# EAGLE design wemos_d1_mini_pro (EAGLE 9.6.2)
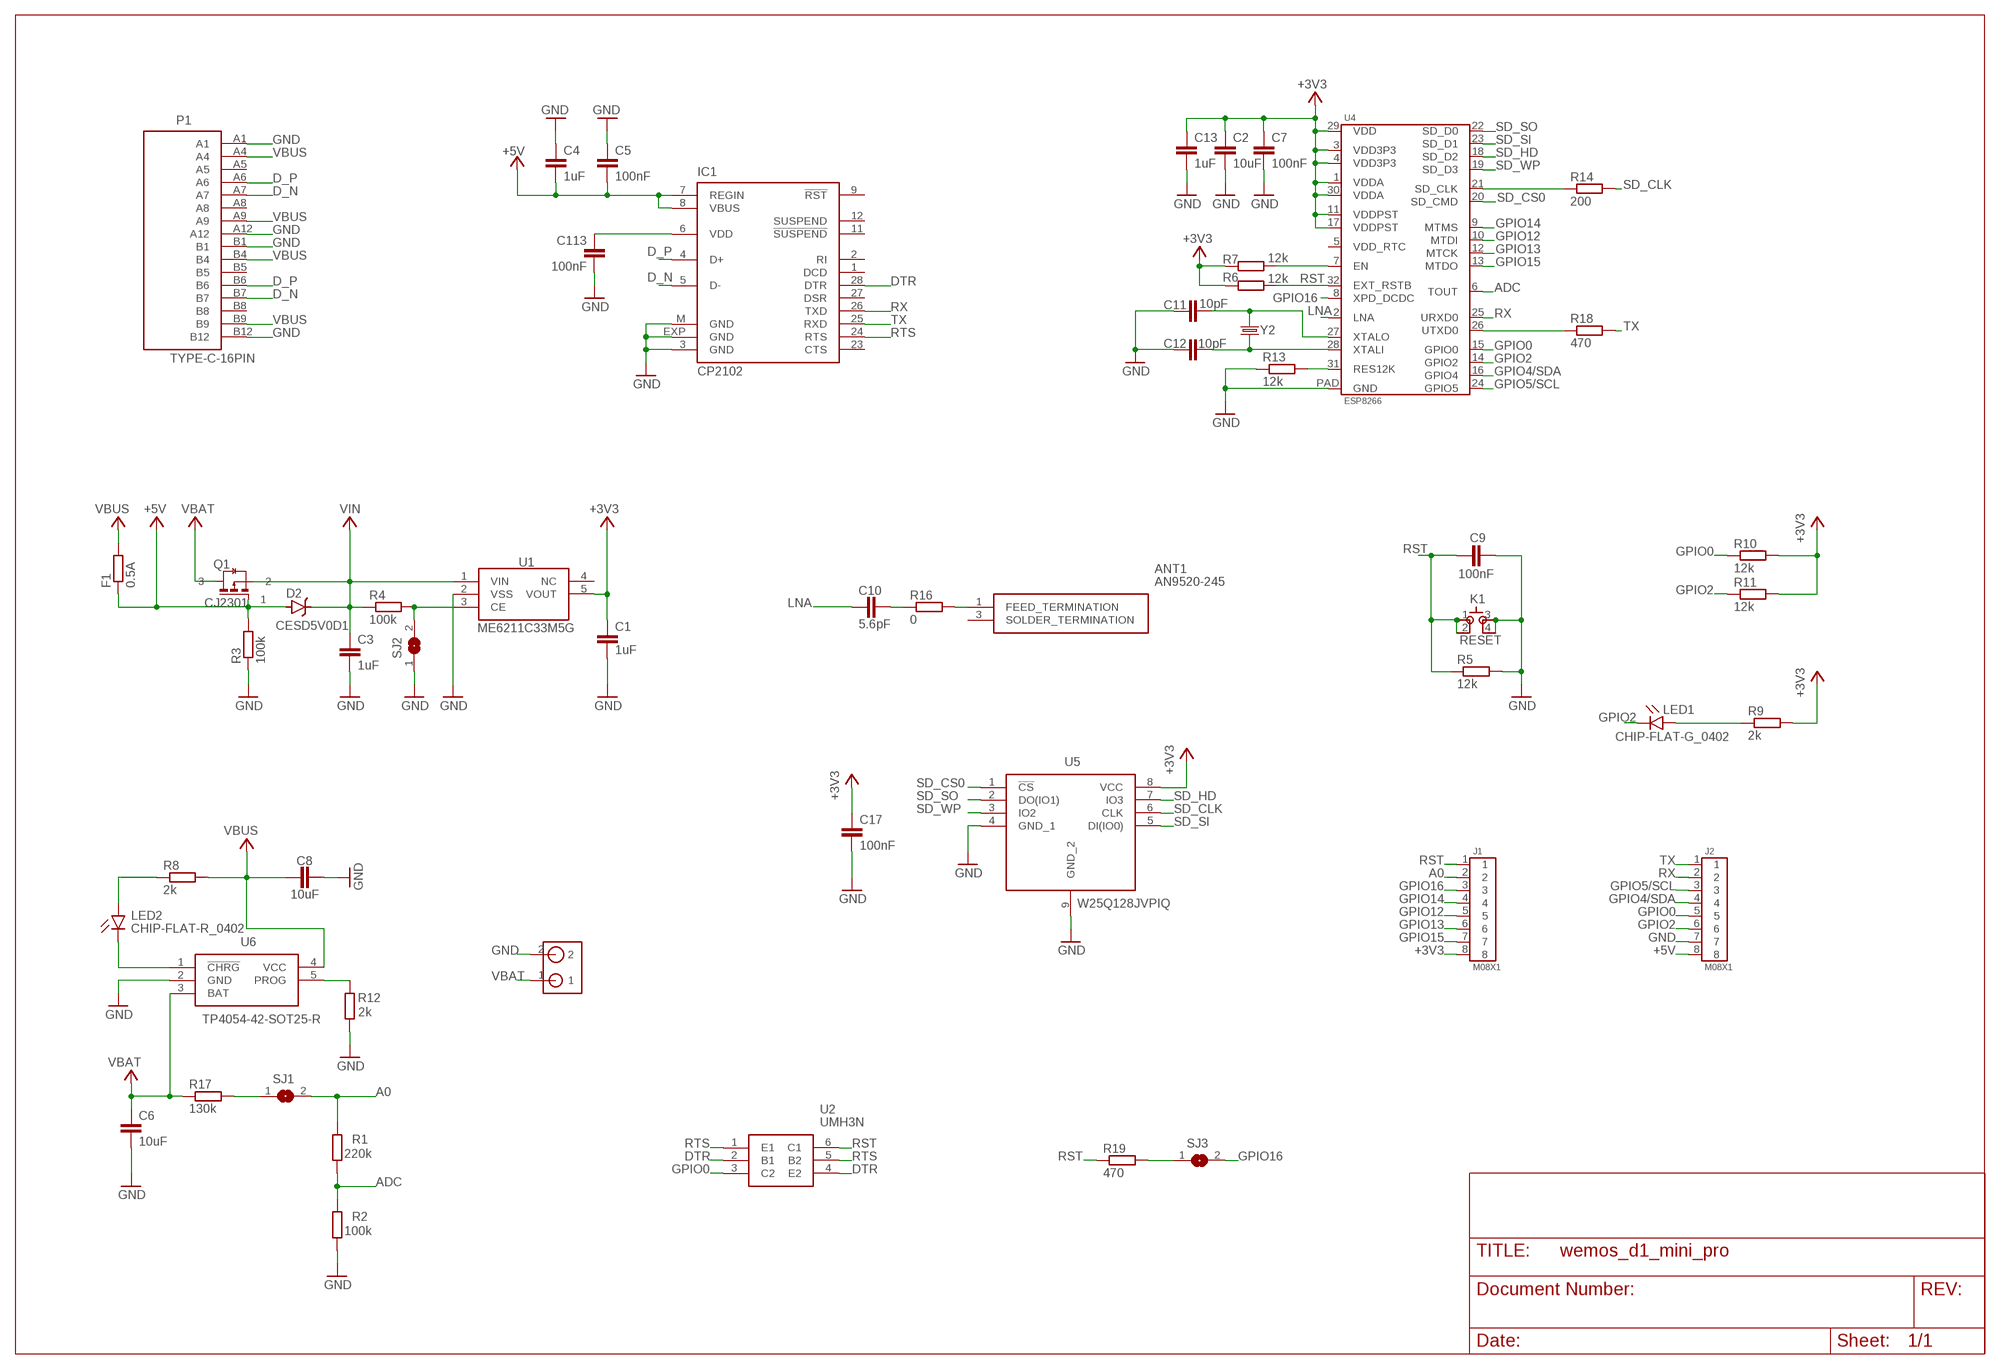
[diagram p0: schematic, sheet 1]

## Parts
ANT1  AN9520-245  [AN9520245]
C1  1uF  C-EUC0402  [C0402]
C2  10uF  C-EUC0402  [C0402]
C3  1uF  C-EUC0402  [C0402]
C4  1uF  C-EUC0402  [C0402]
C5  100nF  C-EUC0402  [C0402]
C6  10uF  C-EUC0402  [C0402]
C7  100nF  C-EUC0402  [C0402]
C8  10uF  C-EUC0402  [C0402]
C9  100nF  C-EUC0402  [C0402]
C10  5.6pF  C-EUC0402  [C0402]
C11  10pF  C-EUC0402  [C0402]
C12  10pF  C-EUC0402  [C0402]
C13  1uF  C-EUC0402  [C0402]
C17  100nF  C-EUC0402  [C0402]
C113  100nF  C-EUC0402  [C0402]
D2  CESD5V0D1  [SOD-123]
F1  0.5A  R-EU_R0402  [R0402]
IC1  CP2102  [MLP28]
J1  M08X1  [M08X1]
J2  M08X1  [M08X1]
K1  RESET  SKSCLDE010  [SKSCLDE010]
LED1  CHIP-FLAT-G_0402  [LEDC1005X25N_FLAT-G]
LED2  CHIP-FLAT-R_0402  [LEDC1005X25N_FLAT-R]
P1  TYPE-C-16PIN  [TYPE-C-16PIN]
Q1  CJ2301  [SOT95P240X115-3N]
R1  220k  R-EU_R0402  [R0402]
R2  100k  R-EU_R0402  [R0402]
R3  100k  R-EU_R0402  [R0402]
R4  100k  R-EU_R0402  [R0402]
R5  12k  R-EU_R0402  [R0402]
R6  12k  R-EU_R0402  [R0402]
R7  12k  R-EU_R0402  [R0402]
R8  2k  R-EU_R0402  [R0402]
R9  2k  R-EU_R0402  [R0402]
R10  12k  R-EU_R0402  [R0402]
R11  12k  R-EU_R0402  [R0402]
R12  2k  R-EU_R0402  [R0402]
R13  12k  R-EU_R0402  [R0402]
R14  200  R-EU_R0402  [R0402]
R16  0  R-EU_R0402  [R0402]
R17  130k  R-EU_R0402  [R0402]
R18  470  R-EU_R0402  [R0402]
R19  470  R-EU_R0402  [R0402]
SJ1  SJ  [SJ]
SJ2  SJ  [SJ]
SJ3  SJ  [SJ]
U1  ME6211C33M5G  [SOT95P282X145-5N]
U2  UMH3N  [SOT65P230X110-6N]
U4  ESP8266  [ESP8266]
U5  W25Q128JVPIQ  [SON127P800X600X80-9N]
U6  TP4054-42-SOT25-R  [SOT95P280X100-5N]
U$1  ZH1.25  [1.25X2-FLAT]
Y2  YSX321SL  [SMD-3225-4]

## Nets
+3V3: C1.1 C2.1 C7.1 C13.1 C17.1 J1.8 R6.1 R7.1 R9.2 R10.2 R11.2 U1.5(VOUT) U4.1(VDDA) U4.3(VDD3P3) U4.4(VDD3P3) U4.11(VDDPST) U4.17(VDDPST) U4.29(VDD) U4.30(VDDA) U5.8(VCC)
+5V: C4.2 C5.2 D2.A F1.1 IC1.7(REGIN) IC1.8(VBUS) J2.8 Q1.1 R3.2
A0: J1.2 R1.2 SJ1.2
ADC: R1.1 R2.2 U4.6(TOUT)
D_N: IC1.5(D-) P1.A7 P1.B7
D_P: IC1.4(D+) P1.A6 P1.B6
DTR: IC1.28(DTR) U2.2(B1) U2.4(E2)
EN: R4.2 SJ2.2 U1.3(CE)
GND: C1.2 C2.2 C3.2 C4.1 C5.1 C6.2 C7.2 C8.2 C9.2 C11.1 C12.1 C13.2 C17.2 C113.2 IC1.3(GND) IC1.EXP(GND) IC1.M(GND) J2.7 K1.3 K1.4 P1.A1 P1.A12 P1.B1 P1.B12 R2.1 R3.1 R5.2 R12.1 R13.1 SJ2.1 U1.2(VSS) U4.PAD(GND) U5.4(GND_1) U5.9(GND_2) U6.2(GND) U$1.2
GPIO0: J2.5 R10.1 U2.3(C2) U4.15(GPIO0)
GPIO2: J2.6 LED1.C R11.1 U4.14(GPIO2)
GPIO4/SDA: J2.4 U4.16(GPIO4)
GPIO5/SCL: J2.3 U4.24(GPIO5)
GPIO12: J1.5 U4.10(MTDI)
GPIO13: J1.6 U4.12(MTCK)
GPIO14: J1.4 U4.9(MTMS)
GPIO15: J1.7 U4.13(MTDO)
GPIO16: J1.3 SJ3.2 U4.8(XPD_DCDC)
LNA: C10.1 U4.2(LNA)
N$1: C113.1 IC1.6(VDD)
N$2: C12.2 U4.28(XTALI) Y2.1
N$3: C11.2 U4.27(XTALO) Y2.3
N$4: R13.2 U4.31(RES12K)
N$5: R7.2 U4.7(EN)
N$6: R12.2 U6.5(PROG)
N$7: C10.2 R16.1
N$8: R14.1 U4.21(SD_CLK)
N$9: R18.1 U4.26(UTXD0)
N$10: ANT1.1(FEED_TERMINATION) R16.2
N$11: LED1.A R9.1
N$12: LED2.A R8.1
N$13: LED2.C U6.1(!CHRG)
N$14: R17.2 SJ1.1
N$16: R19.2 SJ3.1
RST: C9.1 J1.1 K1.1 K1.2 R5.1 R6.2 R19.1 U2.6(C1) U4.32(EXT_RSTB)
RTS: IC1.24(RTS) U2.1(E1) U2.5(B2)
RX: IC1.26(TXD) J2.2 U4.25(URXD0)
SD_CLK: R14.2 U5.6(CLK)
SD_CS0: U4.20(SD_CMD) U5.1(!CS)
SD_HD: U4.18(SD_D2) U5.7(IO3)
SD_SI: U4.23(SD_D1) U5.5(DI(IO0))
SD_SO: U4.22(SD_D0) U5.2(DO(IO1))
SD_WP: U4.19(SD_D3) U5.3(IO2)
TX: IC1.25(RXD) J2.1 R18.2
VBAT: C6.1 Q1.3 R17.1 U6.3(BAT) U$1.1
VBUS: C8.1 F1.2 P1.A4 P1.A9 P1.B4 P1.B9 R8.2 U6.4(VCC)
VIN: C3.1 D2.C Q1.2 R4.1 U1.1(VIN)
Unconnected: ANT1.3(SOLDER_TERMINATION) IC1.1(DCD) IC1.2(RI) IC1.9(!RST) IC1.11(!SUSPEND) IC1.12(SUSPEND) IC1.23(CTS) IC1.27(DSR) P1.A5 P1.A8 P1.B5 P1.B8 U1.4(NC) U4.5(VDD_RTC)

## Library data of the parts
ANT1 = antenna:AN9520-245: SMD Antennas RoHS Source: Datasheet <https://datasheet.lcsc.com/szlcsc/1810251713_Rainsun-microwave-Tech-AN9520-245_C99665.pdf>; DESCRIPTION: SMD Antennas RoHS; HEIGHT: 1.2mm; MANUFACTURER_NAME: Rainsun microwave Tech; MANUFACTURER_PART_NUMBER: AN9520-245
C1-C13 C17 C113 = rcl:C-EU: CAPACITOR, European symbol; SPICEPREFIX: C
D2 = Diodes:CESD5V0D1: SOD-123 Plastic-Encapsulate Diodes Uni-direction ESD Protection Diode Manufacturer's datasheet <https://seeeddoc.github.io/Open_parts_library/res/304060001.pdf>; CREATED_BY: PCBLayout.com; MANUFACTURER: JCET; MPN: CESD5V0D1; PACKAGE: SOD-123
F1 R1-R14 R16-R19 = rcl:R-EU_: RESISTOR, European symbol; SPICEPREFIX: R
IC1 = silabs:CP210*: Single-Chip USB to UART Bridge Source: www.silabs.com .. CP2101.pdf / cp2102.pdf; MF: FARNELL; MPN: CP2102-GM; OC_FARNELL: 9282130; OC_NEWARK: 30K5635
J1 J2 = Connectors:M08X1
K1 = alps:SKSCLDE010
LED1 = LED:CHIP-FLAT-G; CATEGORY: LED; COLOR: GREEN; DESCRIPTION: CHIP LED FLAT; SUB-CATEGORY: CHIP; TYPE: FLAT_TOP
LED2 = LED:CHIP-FLAT-R; CATEGORY: LED; COLOR: RED; DESCRIPTION: CHIP LED FLAT; SUB-CATEGORY: CHIP; TYPE: FLAT_TOP
P1 = usb:TYPE-C-16PIN
Q1 = library:CJ2301
SJ1-SJ3 = jumper:SJ: SMD solder JUMPER
U1 = library:ME6211C33M5G: High Speed LDO Regulators, High PSRR, Low noise, ME6211 Series Source: Datasheet <http://xinhuidianzi.com.cn/UploadSysFiles/files/LDO-series/ME6211-Series_E15.0.pdf>; DESCRIPTION: High Speed LDO Regulators, High PSRR, Low noise, ME6211 Series; HEIGHT: 1.45mm; MANUFACTURER_NAME: Microne; MANUFACTURER_PART_NUMBER: ME6211C33M5G
U2 = UMH3N:UMH3N: 2 NPN pre-biased (Dual) 100mA 50V SC-70-6(SOT-363) Digital Transistors RoHS Source: Datasheet <https://datasheet.lcsc.com/szlcsc/Changjiang-Electronics-Tech-CJ-UMH3N_C62892.pdf>; DESCRIPTION: 2 NPN pre-biased (Dual) 100mA 50V SC-70-6(SOT-363) Digital Transistors RoHS; HEIGHT: 1.1mm; MANUFACTURER_NAME: Changjiang Electronics Tech (CJ); MANUFACTURER_PART_NUMBER: UMH3N
U4 = Espressif:ESP8266
U5 = flash:W25Q128JVPIQ: IC FLASH 128M SPI 133MHZ 8WSON Source: Datasheet <https://www.arrow.com/en/products/w25q128jvpiq/winbond-electronics>; ARROW_PART_NUMBER: W25Q128JVPIQ; ARROW_PRICE-STOCK: https://www.arrow.com/en/products/w25q128jvpiq/winbond-electronics; DESCRIPTION: IC FLASH 128M SPI 133MHZ 8WSON; HEIGHT: 0.8mm; MANUFACTURER_NAME: Winbond; MANUFACTURER_PART_NUMBER: W25Q128JVPIQ; MOUSER_PART_NUMBER: 454-W25Q128JVPIQ; MOUSER_PRICE-STOCK: https://www.mouser.co.uk/ProductDetail/Winbond/W25Q128JVPIQ?qs=qSfuJ%252Bfl%2Fd676hAD%252B1JSfw%3D%3D
U6 = TP4054-42-SOT25-R:TP4054-42-SOT25-R: Standalone Linear Li-ion Battery Charger with Thermal Regulation, SOT-23-5 Source: Datasheet <http://images.100y.com.tw/pdf_file/38-TP-TP4054x.pdf>; DESCRIPTION: Standalone Linear Li-ion Battery Charger with Thermal Regulation, SOT-23-5; HEIGHT: 1mm; MANUFACTURER_NAME: TOP POWER; MANUFACTURER_PART_NUMBER: TP4054-42-SOT25-R
U$1 = Connectors:ZH1.25
Y2 = crystal:YSX321SL

## Board
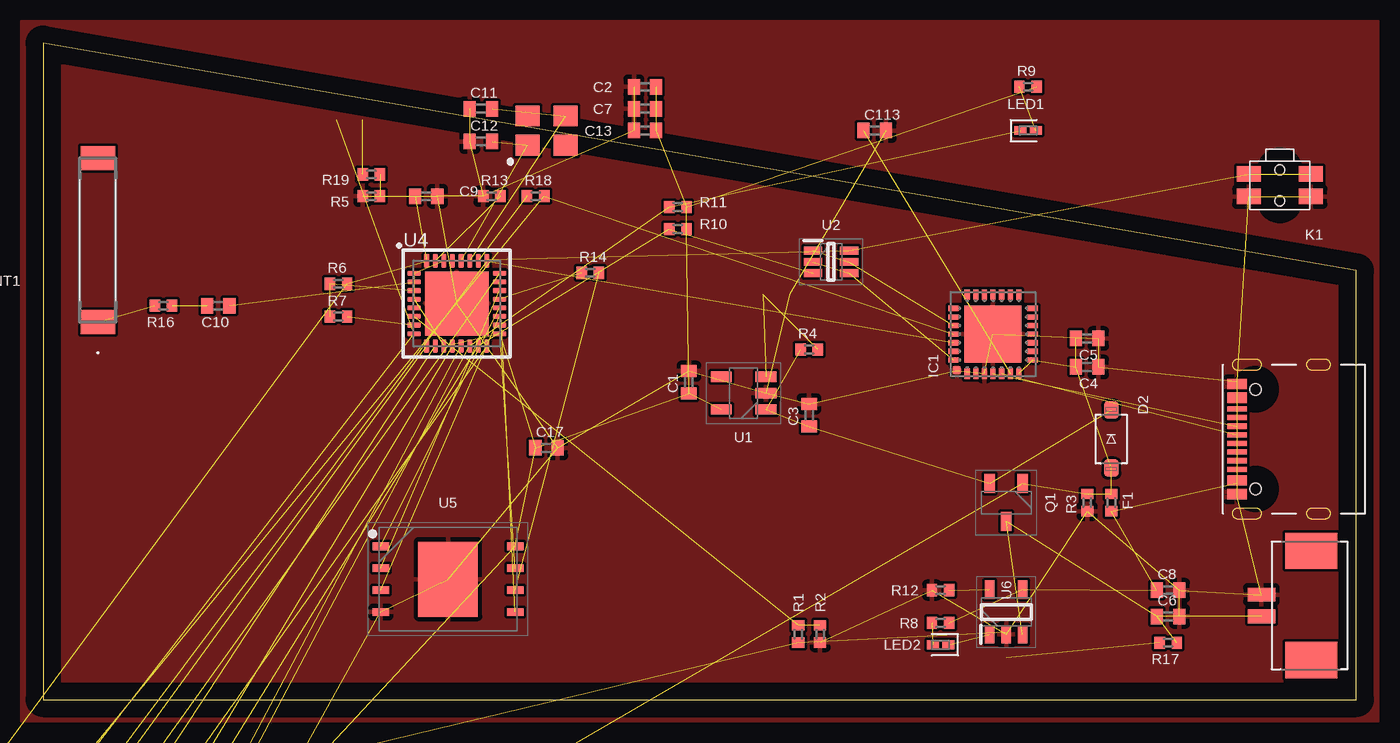
[diagram p1: board, top side]
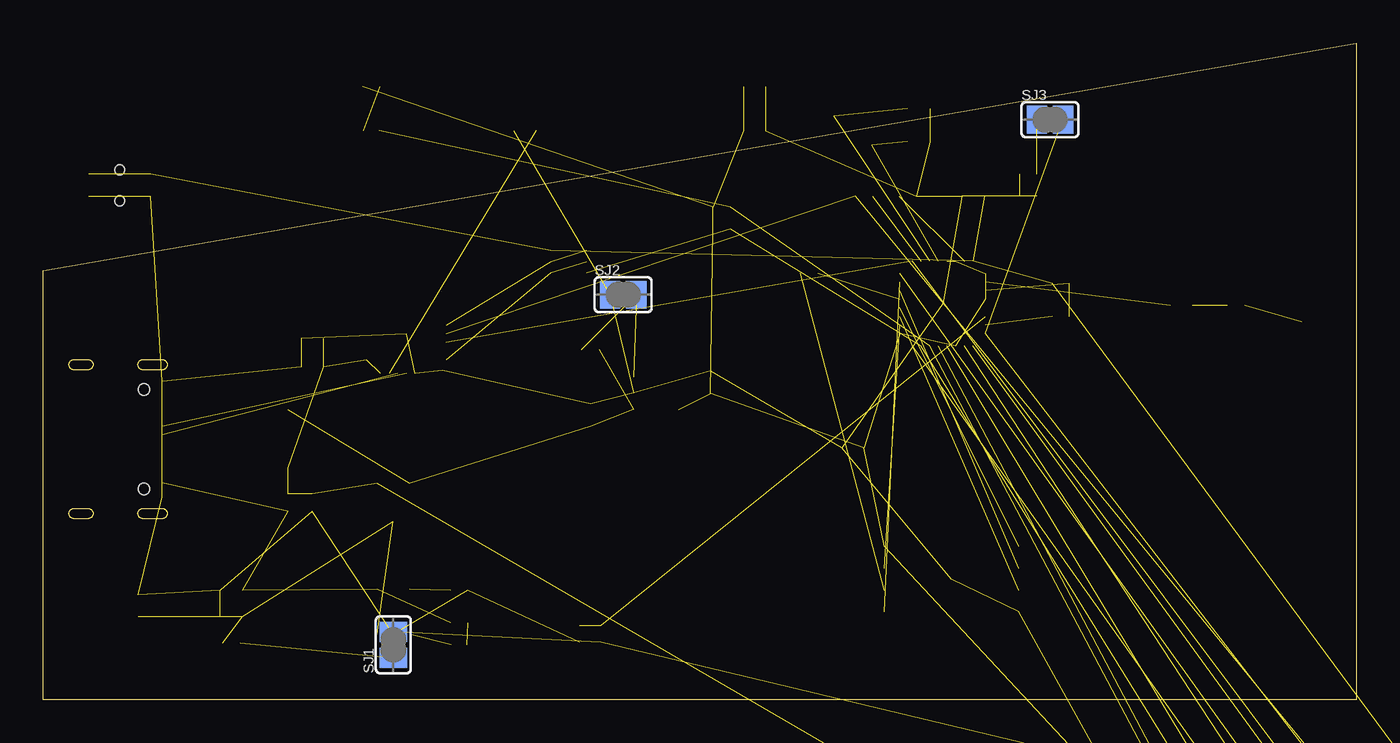
[diagram p2: board, bottom side, seen from below]

Size 76.2 x 38.1 mm. Coordinates in mm from the lower left corner, seen from the top.
Outline: 0,0 76.2,0 76.2,24.89 0,38.1 0,0
Copper layers (1*16): Top 0.035mm / dielectric 1.5mm / Bottom 0.035mm
Design rules "default": minimum track width 6mil, minimum drill 0.35mm, track to track 6mil, track to pad 6mil, pad to pad 6mil, via to via 6mil, smd to smd 6mil, copper to edge 40mil, drill to drill 6mil, minimum pad ring 10mil, minimum via ring 8mil, stop-mask expansion 4mil, vias tented up to drill 0mil, thermal gap 10mil

### Footprints (pad centres in the part's own frame; a part is rotated, then mirrored left to right if it is on the bottom)
AN9520245 = smd 2 x 1.4: 1 0,4.75; 3 0,-4.75
C0402 = smd 0.7 x 0.9: 1 -0.65,0; 2 0.65,0
SOD-123 = smd 1.02 x 0.86: A 1.68,0; C -1.68,0
R0402 = smd 0.6 x 0.7: 1 -0.5,0; 2 0.5,0
MLP28 = smd 0.6 x 0.3: 1 -2.3,1.5; 2 -2.3,1; 3 -2.3,0.5; 4 -2.3,0; 5 -2.3,-0.5; 6 -2.3,-1; 7 -2.3,-1.5; 15 2.3,-1.5; 16 2.3,-1; 17 2.3,-0.5; 18 2.3,0; 19 2.3,0.5; 20 2.3,1; 21 2.3,1.5 | smd 0.3 x 0.6: 8 -1.5,-2.3; 9 -1,-2.3; 10 -0.5,-2.3; 11 0,-2.3; 12 0.5,-2.3; 13 1,-2.3; 14 1.5,-2.3; 22 1.5,2.3; 23 1,2.3; 24 0.5,2.3; 25 0,2.3; 26 -0.5,2.3; 27 -1,2.3; 28 -1.5,2.3 | smd 3.3 x 3.3: EXP 0,0 | smd 0.435 x 0.435: M -2.103,2.103
M08X1 = drill 1.016 pad 1.88 square: 1 0,0 | drill 1.016 pad 1.88: 2 2.54,0; 3 5.08,0; 4 7.62,0; 5 10.16,0; 6 12.7,0; 7 15.24,0; 8 17.78,0
SKSCLDE010 = smd 1.4 x 0.9: 1 -1.8,-0.65; 2 1.8,-0.65; 3 -1.8,0.65; 4 1.8,0.65 | hole 0.55: 0,0.9; 0,-0.9
LEDC1005X25N_FLAT-G = smd 0.7 x 0.5: A 0.45,0; C -0.45,0
LEDC1005X25N_FLAT-R = smd 0.7 x 0.5: A 0.45,0; C -0.45,0
TYPE-C-16PIN = smd 0.3 x 1.15: A1 -3.35,0.575; A4 -2.55,0.575; A5 -1.25,0.575; A6 -0.25,0.575; A7 0.25,0.575; A8 -1.75,0.575; A9 2.55,0.575; A12 3.35,0.575; B1 3.05,0.575; B4 2.25,0.575; B5 1.75,0.575; B6 0.75,0.575; B7 -0.75,0.575; B8 1.25,0.575; B9 -2.25,0.575; B12 -3.05,0.575 | hole 0.65: -2.89,-0.5; 2.89,-0.5
SOT95P240X115-3N = smd 1.1 x 0.6: 1 -1.1,0.95; 2 -1.1,-0.95; 3 1.1,0
SJ = smd 1.168 x 1.6: 1 -0.762,0; 2 0.762,0
SOT95P282X145-5N = smd 1.2 x 0.6: 1 -1.3,0.95; 2 -1.3,0; 3 -1.3,-0.95; 4 1.3,-0.95; 5 1.3,0.95
SOT65P230X110-6N = smd 1.05 x 0.45: 1 -1.05,0.65; 2 -1.05,0; 3 -1.05,-0.65; 4 1.05,-0.65; 5 1.05,0; 6 1.05,0.65
ESP8266 = smd 0.8 x 0.3: 1 -2.475,1.75; 2 -2.475,1.25; 3 -2.475,0.75; 4 -2.475,0.25; 5 -2.475,-0.25; 6 -2.475,-0.75; 7 -2.475,-1.25; 8 -2.475,-1.75; 17 2.475,-1.75; 18 2.475,-1.25; 19 2.475,-0.75; 20 2.475,-0.25; 21 2.475,0.25; 22 2.475,0.75; 23 2.475,1.25; 24 2.475,1.75 | smd 0.3 x 0.8: 9 -1.75,-2.475; 10 -1.25,-2.475; 11 -0.75,-2.475; 12 -0.25,-2.475; 13 0.25,-2.475; 14 0.75,-2.475; 15 1.25,-2.475; 16 1.75,-2.475; 25 1.75,2.475; 26 1.25,2.475; 27 0.75,2.475; 28 0.25,2.475; 29 -0.25,2.475; 30 -0.75,2.475; 31 -1.25,2.475; 32 -1.75,2.475 | smd 3.7 x 3.7: PAD 0,0
SON127P800X600X80-9N = smd 0.95 x 0.45: 1 -3.9,1.905; 2 -3.9,0.635; 3 -3.9,-0.635; 4 -3.9,-1.905; 5 3.9,-1.905; 6 3.9,-0.635; 7 3.9,0.635; 8 3.9,1.905 | smd 3.45 x 4.35: 9 0,0
SOT95P280X100-5N = smd 1.05 x 0.55: 1 -1.3,0.95; 2 -1.3,0; 3 -1.3,-0.95; 4 1.3,-0.95; 5 1.3,0.95
1.25X2-FLAT = smd 2.1 x 3: 0 -3.175,-1.45; 3 3.175,-1.45 | smd 0.8 x 1.6: 1 -0.625,1.45; 2 0.625,1.45
SMD-3225-4 = smd 1.4 x 1.2: 1 -1.1,-0.85; 3 1.1,0.85; GND2 1.1,-0.85; GND4 -1.1,0.85

### Placement (x,y rotation side)
ANT1  3.17,26.67 180 top
C1  37.47,18.41 90 top
C2  34.92,35.56 180 top
C3  44.45,16.51 90 top
C4  60.58,19.3 180 top
C5  60.58,20.95 180 top
C6  65.28,4.83 0 top
C7  34.92,34.29 180 top
C8  65.28,6.35 0 top
C9  22.23,29.21 0 top
C10  10.16,22.86 180 top
C11  25.4,34.29 0 top
C12  25.4,32.38 0 top
C13  34.92,33.02 180 top
C17  29.21,14.61 0 top
C113  48.26,33.02 0 top
D2  61.98,15.11 270 top
F1  61.98,11.43 270 top
IC1  55.12,21.21 90 top
J1  -6.1,-8 0 top  (outside the outline)
J2  -6.1,-13.72 0 top  (outside the outline)
K1  71.75,29.84 180 top
LED1  57.15,33.02 0 top
LED2  52.07,3.17 180 top
P1  69.85,15.11 90 top
Q1  55.88,11.43 270 top
R1  43.81,3.81 270 top
R2  45.09,3.81 90 top
R3  60.58,11.43 90 top
R4  44.45,20.32 0 top
R5  19.05,29.21 180 top
R6  17.14,24.13 0 top
R7  17.14,22.23 0 top
R8  52.07,4.45 0 top
R9  57.15,35.56 0 top
R10  36.83,27.3 0 top
R11  36.83,28.57 0 top
R12  52.07,6.35 0 top
R13  26.04,29.21 0 top
R14  31.75,24.77 0 top
R16  6.99,22.86 180 top
R17  65.28,3.3 180 top
R18  28.57,29.21 0 top
R19  19.05,30.48 180 top
SJ1  55.88,3.17 90 bottom
SJ2  42.55,23.5 0 bottom
SJ3  17.78,33.66 0 bottom
U1  40.64,17.78 180 top
U2  45.72,25.4 0 top
U4  24,22.99 0 top
U5  23.5,6.99 0 top
U6  55.88,5.08 90 top
U$1  72.14,5.46 90 top
Y2  29.21,33.02 0 top

### Tracks (layer width: path | path; a pad name or v marks a point on that pad's centre or on a via)
+3V3  (19 unrouted)
+5V  (8 unrouted)
A0  (2 unrouted)
ADC  (2 unrouted)
D_N  (2 unrouted)
D_P  (2 unrouted)
DTR  (2 unrouted)
EN  (2 unrouted)
GND  (35 unrouted)
  pour Top: -1.27,-1.27 -1.27,39.37 77.47,39.37 77.47,-1.27
GPIO0  (3 unrouted)
GPIO2  (3 unrouted)
GPIO4/SDA  (1 unrouted)
GPIO5/SCL  (1 unrouted)
GPIO12  (1 unrouted)
GPIO13  (1 unrouted)
GPIO14  (1 unrouted)
GPIO15  (1 unrouted)
GPIO16  (2 unrouted)
LNA  (1 unrouted)
N$1  (1 unrouted)
N$2  (2 unrouted)
N$3  (2 unrouted)
N$4  (1 unrouted)
N$5  (1 unrouted)
N$6  (1 unrouted)
N$7  (1 unrouted)
N$8  (1 unrouted)
N$9  (1 unrouted)
N$10  (1 unrouted)
N$11  (1 unrouted)
N$12  (1 unrouted)
N$13  (1 unrouted)
N$14  (1 unrouted)
N$16  (1 unrouted)
RST  (8 unrouted)
RTS  (2 unrouted)
RX  (2 unrouted)
SD_CLK  (1 unrouted)
SD_CS0  (1 unrouted)
SD_HD  (1 unrouted)
SD_SI  (1 unrouted)
SD_SO  (1 unrouted)
SD_WP  (1 unrouted)
TX  (2 unrouted)
VBAT  (4 unrouted)
VBUS  (7 unrouted)
VIN  (4 unrouted)